# EAGLE design PiHome_Smart_Home_Gateway_v08_HT7833 (EAGLE 9.5.2)
PiHome - Smart Heating, Ventilation and Air Conditioning (HVAC) Wi-Fi Smart Home Gateway based on MySensors library with NodeMCU and nRF24L01 PA LNA Note: Power by micro USB with minimum 2amp for better performance. For more information on PiHome Smart Heating: http://www.pihome.eu
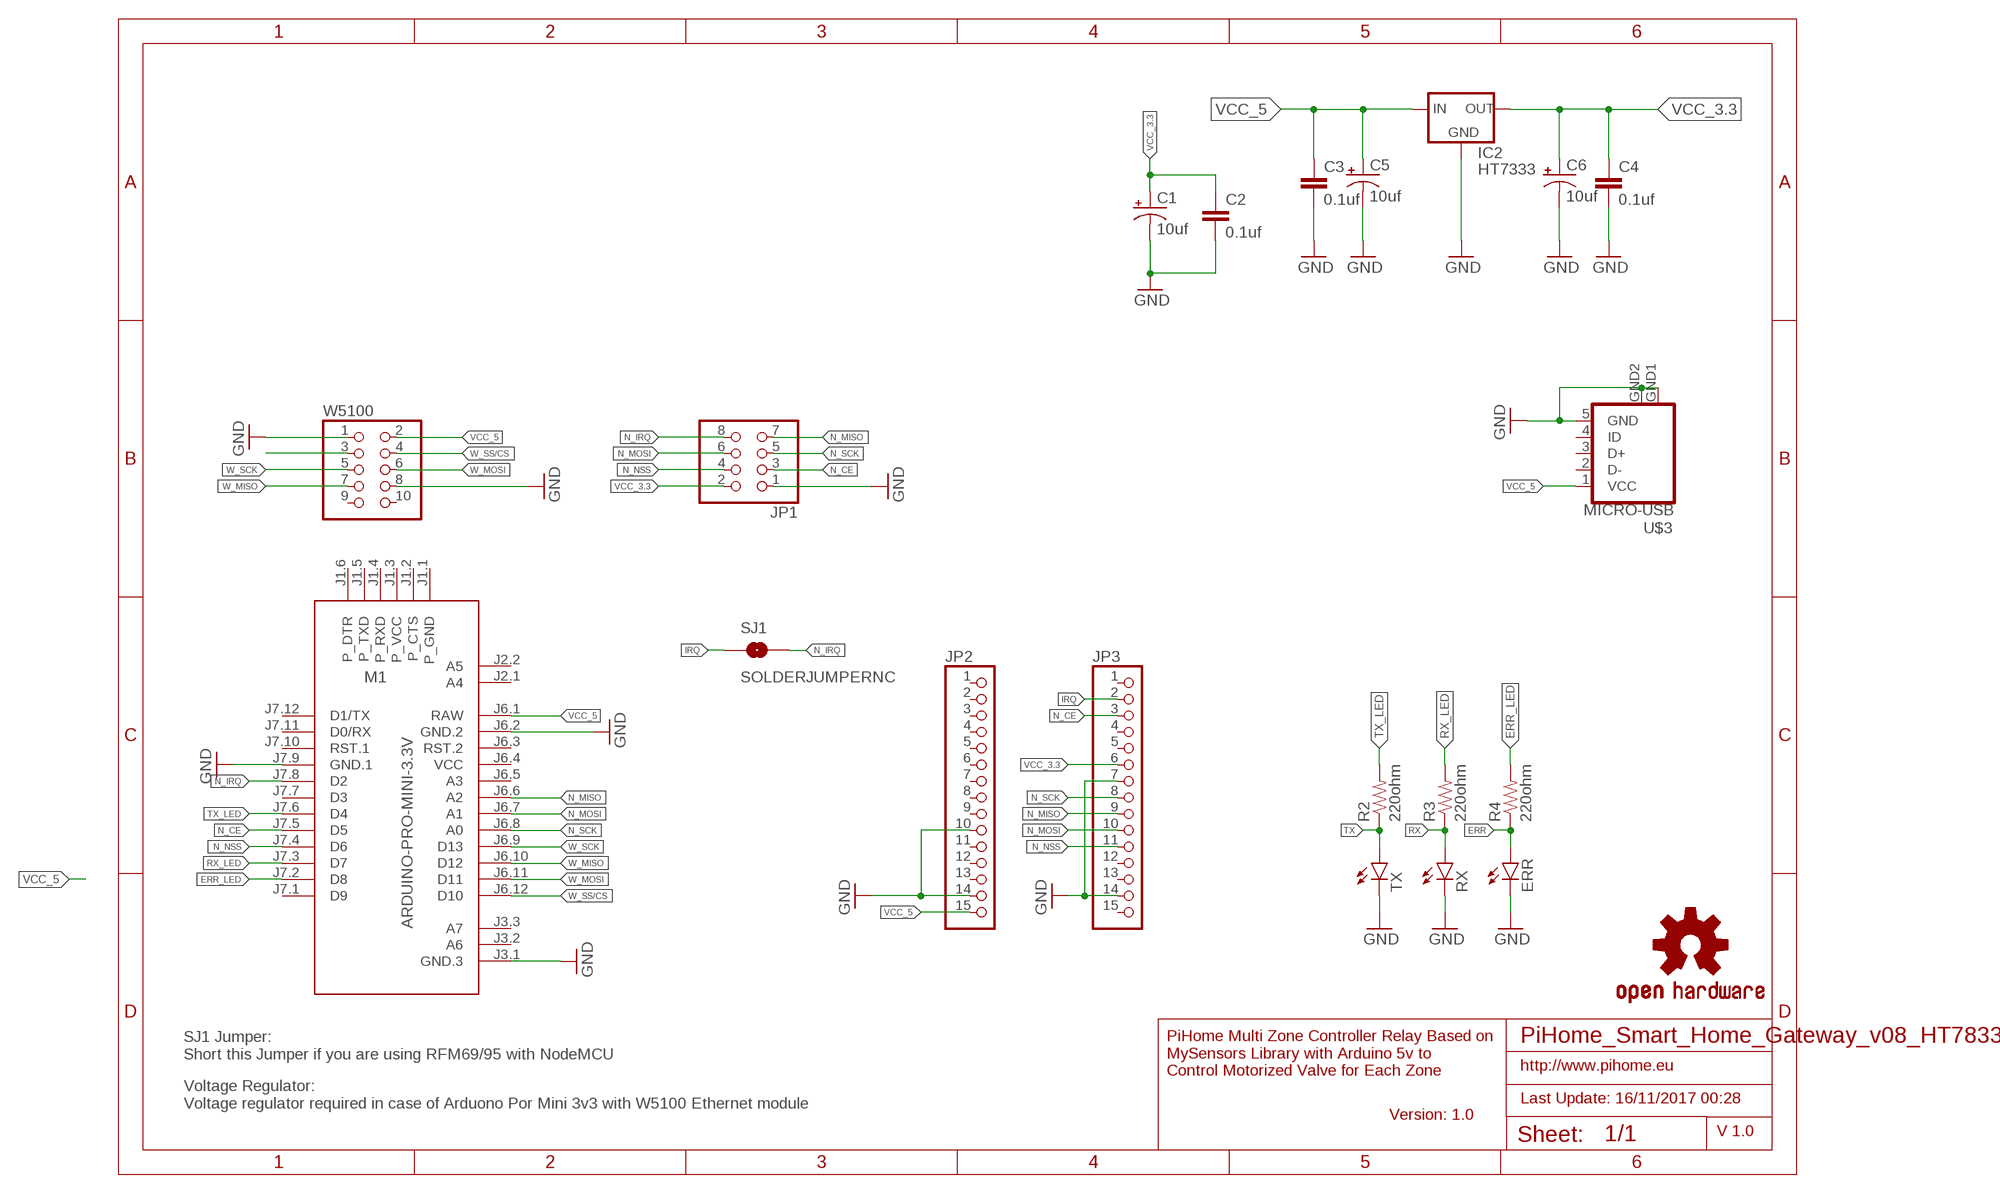
[diagram p0: schematic, sheet 1]

## Parts
C1  10uf  10UF-25V-20%(PTH)KIT  [CPOL-RADIAL-10UF-25V-KIT]
C2  0.1uf  0.1UF-50V-20%(PTH)KIT-EZ  [CAP-PTH-SMALL-KIT]
C3  0.1uf  0.1UF-50V-20%(PTH)KIT-EZ  [CAP-PTH-SMALL-KIT]
C4  0.1uf  0.1UF-50V-20%(PTH)KIT-EZ  [CAP-PTH-SMALL-KIT]
C5  10uf  10UF-25V-20%(PTH)KIT  [CPOL-RADIAL-10UF-25V-KIT]
C6  10uf  10UF-25V-20%(PTH)KIT  [CPOL-RADIAL-10UF-25V-KIT]
ERR  LED3MM  [LED3MM]
IC2  HT7333  [SOT-89]
JP1  PINHD-2X4  [2X04]
JP2  PINHD-1X15-CB  [1X15-CB]
JP3  PINHD-1X15-CB  [1X15-CB]
LOGO1  OSHW-LOGOMINI  [OSHW-LOGO-MINI]
M1  ARDUINO-PRO-MINI-3.3V  [ARDUINO-PRO-MINI]
R2  220ohm  RESISTORAXIAL-0.3  [AXIAL-0.3]
R3  220ohm  RESISTORAXIAL-0.3  [AXIAL-0.3]
R4  220ohm  RESISTORAXIAL-0.3  [AXIAL-0.3]
RX  LED3MM  [LED3MM]
SJ1  SOLDERJUMPERNC  [SJ_2S]
TX  LED3MM  [LED3MM]
U$3  MICRO-USB  [MICRO-USB]
W5100  PINHD-2X5  [2X05]

## Nets
ERR: ERR.A R4.P$1
ERR_LED: M1.J7.2(D8) R4.P$2
GND: C1.2(-) C2.2 C3.2 C4.2 C5.2(-) C6.2(-) ERR.K(C) IC2.2(GND) JP1.1 JP2.10 JP2.14 JP3.7 JP3.14 M1.J3.1(GND.3) M1.J6.2(GND.2) M1.J7.9(GND.1) RX.K(C) TX.K(C) U$3.5(GND) U$3.GND1(GND) U$3.GND2(GND) W5100.1 W5100.8
IRQ: JP3.2 SJ1.1
N$1: W5100.3
N_CE: JP1.3 JP3.3 M1.J7.5(D5)
N_IRQ: JP1.8 M1.J7.8(D2) SJ1.2
N_MISO: JP1.7 JP3.9 M1.J6.6(A2)
N_MOSI: JP1.6 JP3.10 M1.J6.7(A1)
N_NSS: JP1.4 JP3.11 M1.J7.4(D6)
N_SCK: JP1.5 JP3.8 M1.J6.8(A0)
RX: R3.P$1 RX.A
RX_LED: M1.J7.3(D7) R3.P$2
TX: R2.P$1 TX.A
TX_LED: M1.J7.6(D4) R2.P$2
VCC_3.3: C1.1(+) C2.1 C4.1 C6.1(+) IC2.1(OUT) JP1.2 JP3.6
VCC_5: C3.1 C5.1(+) IC2.3(IN) IC2.4(IN) JP2.15 M1.J6.1(RAW) U$3.1(VCC) W5100.2
W_MISO: M1.J6.10(D12) W5100.7
W_MOSI: M1.J6.11(D11) W5100.6
W_SCK: M1.J6.9(D13) W5100.5
W_SS/CS: M1.J6.12(D10) W5100.4
Unconnected: JP2.1 JP2.2 JP2.3 JP2.4 JP2.5 JP2.6 JP2.7 JP2.8 JP2.9 JP2.11 JP2.12 JP2.13 JP3.1 JP3.4 JP3.5 JP3.12 JP3.13 JP3.15 M1.J1.1(P_GND) M1.J1.2(P_CTS) M1.J1.3(P_VCC) M1.J1.4(P_RXD) M1.J1.5(P_TXD) M1.J1.6(P_DTR) M1.J2.1(A4) M1.J2.2(A5) M1.J3.2(A6) M1.J3.3(A7) M1.J6.3(RST.2) M1.J6.5(A3) M1.J7.1(D9) M1.J7.7(D3) M1.J7.10(RST.1) M1.J7.11(D0/RX) M1.J7.12(D1/TX) U$3.2(D-) U$3.3(D+) U$3.4(ID) W5100.9 W5100.10

## Notes on the sheet
- SJ1 Jumper:
  Short this Jumper if you are using RFM69/95 with NodeMCU
- http://www.pihome.eu
- PiHome Multi Zone Controller Relay Based on
  MySensors Library with Arduino 5v to 
  Control Motorized Valve for Each Zone
- Last Update: 16/11/2017 00:28
- Voltage Regulator:
  Voltage regulator required in case of Arduono Por Mini 3v3 with W5100 Ethernet module
- Version: 1.0
- V 1.0

## Power pins joined to a net without a drawn wire
VCC: M1.J6.4(VCC)

## Library data of the parts
C1 C5 C6 = SparkFun-Capacitors:10UF-25V-20%(PTH): CAP-08440; PROD_ID: CAP-08440
C2-C4 = SparkFun-Capacitors:0.1UF-50V-20%(PTH): CAP-08370; PROD_ID: CAP-08370
ERR RX TX = SparkFun-LED:LED: LEDs Standard schematic elements and footprints for 5mm, 3mm, 1206, and 0603 sized LEDs. 5mm - Spark Fun Electronics SKU : COM-00529 (and others); PROD_ID: DIO-08794
IC2 = holtek2:HT73*
JP1 = adafruit:PINHD-2X4: PIN HEADER
JP2 JP3 = adafruit:PINHD-1X15: PIN HEADER
LOGO1 = SparkFun-Aesthetics:OSHW-LOGO: Open-Source Hardware (OSHW) Logo This logo indicates the piece of hardware it is found on incorporates a OSHW license and/or adheres to the definition of open source hardware found here: http://freedomdefined.org/OSHW
M1 = diy-modules:ARDUINO-PRO-MINI-*: Arduino Pro Mini and compatible devices More details available here: https://www.arduino.cc/en/Main/ArduinoBoardProMini Click here to find device on ebay.com <http://www.ebay.com/sch/arduino+pro+mini>
R2-R4 = SparkFun-Passives:RESISTOR: Resistor Basic schematic elements and footprints for 0603, 1206, and PTH resistors.
SJ1 = SparkFun-Retired:SOLDERJUMPER: Solder Jumper Standard SMD solder jumper. Used to automate production. Two varients : Normally Open and Normally Closed are the same, but have different paste layers. NC will have a large amount of paste and should jumper during reflow.
U$3 = microusb:MICRO-USB: Micro USB B connector
W5100 = pinhead:PINHD-2X5: PIN HEADER

## Net classes
0 default: width 0.254 mm, drill 0.076 mm, clearance 0.178 mm

## Board
PiHome - Smart Heating, Ventilation and Air Conditioning (HVAC) Wi-Fi Smart Home Gateway based on MySensors library with NodeMCU and nRF24L01 PA LNA Note: Power by micro USB with minimum 2amp for better performance. For more information on PiHome Smart Heating: http://www.pihome.eu
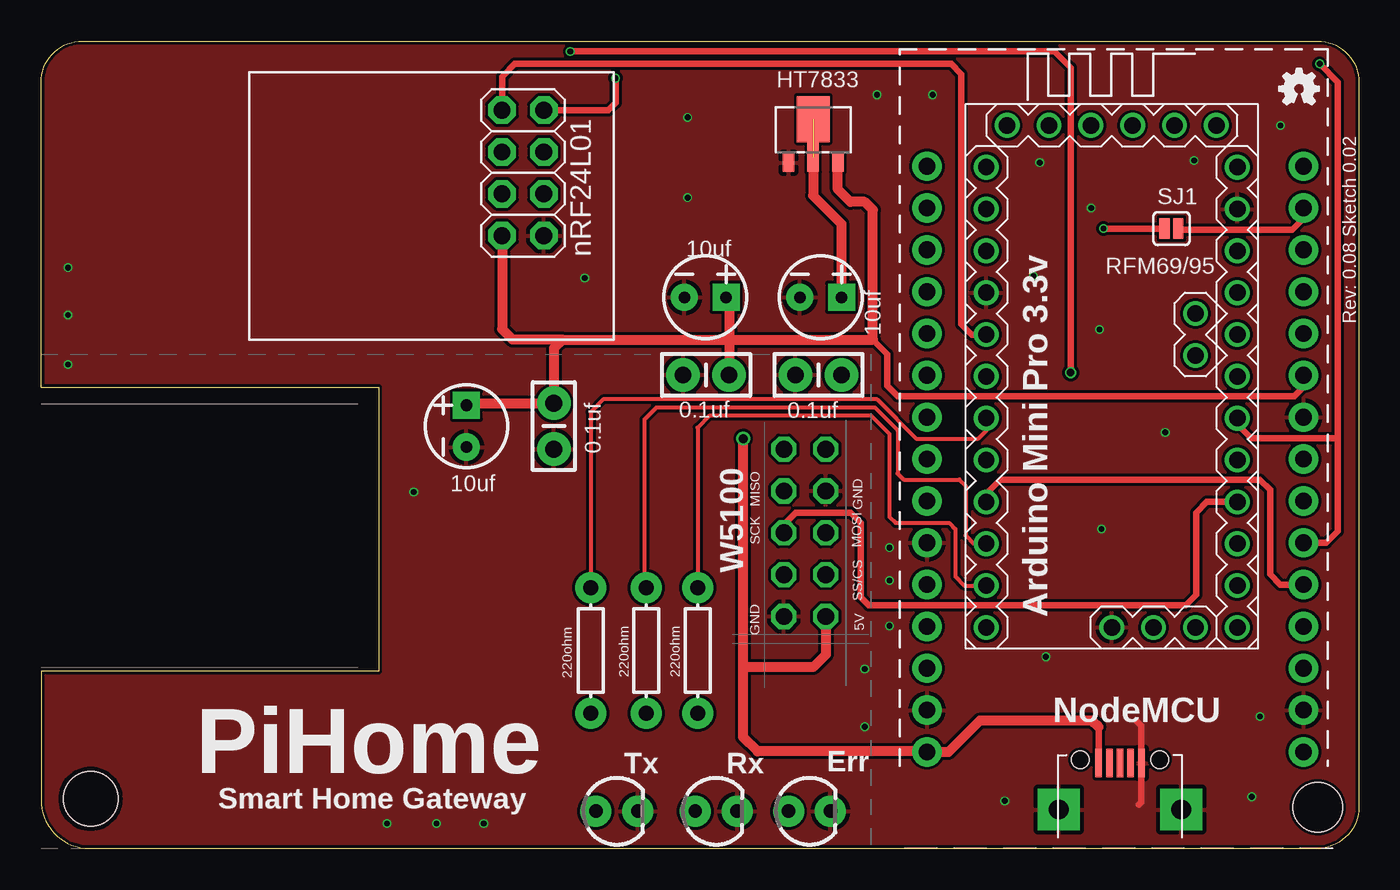
[diagram p1: board, top side]
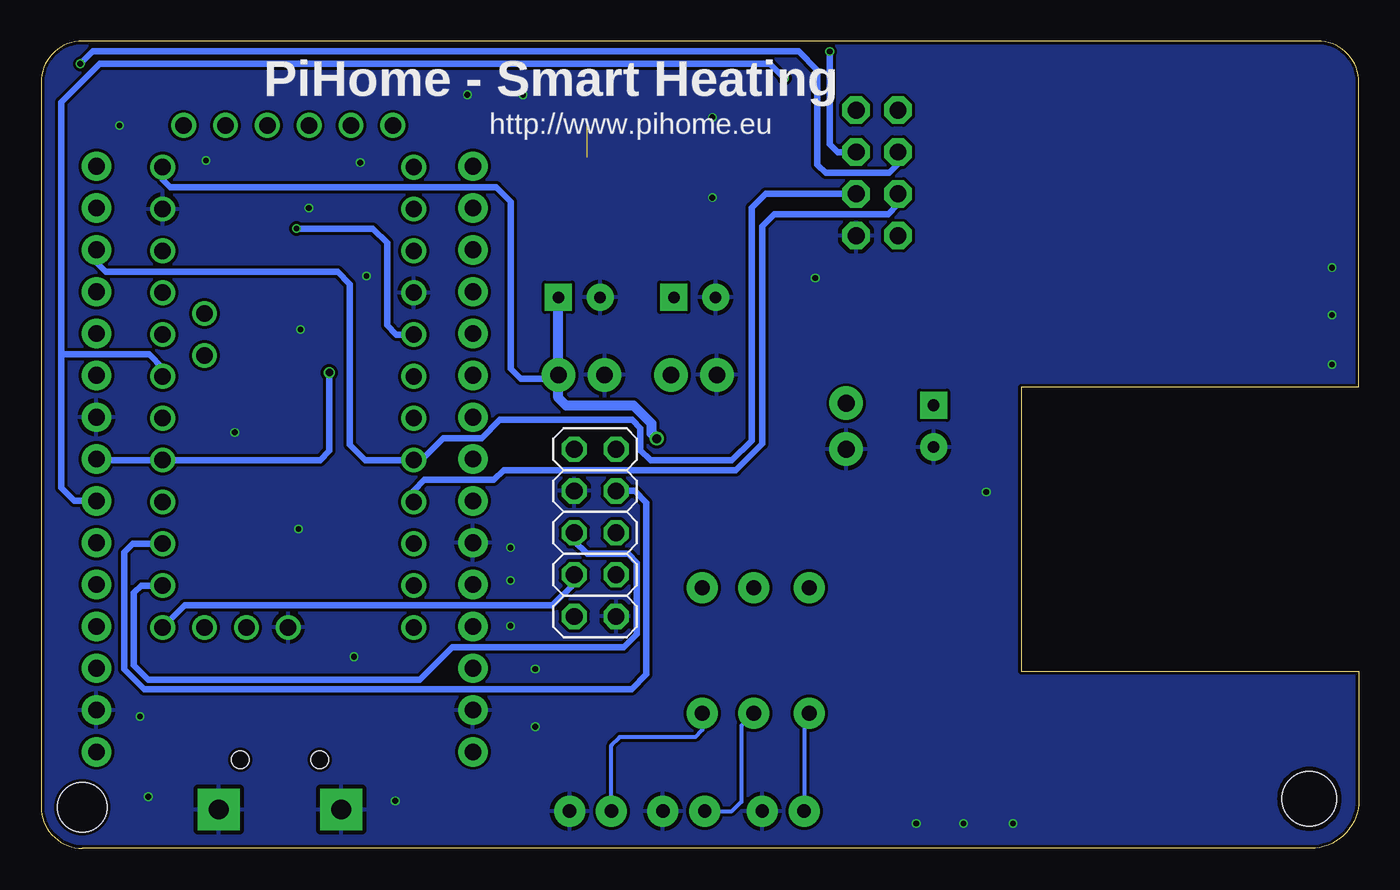
[diagram p2: board, bottom side, seen from below]

Size 80 x 49.01 mm. Coordinates in mm from the lower left corner, seen from the top.
Outline: 3.17,0.01 77.5,0.01 arc90 80,2.51 80,46.51 arc90 77.5,49.01 2.5,49.01 arc90 0,46.51 0,28.01 20.5,28.01 20.5,10.76 0,10.76 0,2.69 arc90 3.17,0.01
Copper layers (1*16): Top 0.035559375mm / dielectric 1.6mm / Bottom 0.035559375mm
Design rules "PiHome - JLCPCB 2 Layer": minimum track width 5mil, minimum drill 12mil, track to track 5mil, track to pad 5mil, pad to pad 5mil, via to via 5mil, smd to smd 5mil, copper to edge 8mil, drill to drill 6mil, minimum pad ring 5mil, minimum via ring 3mil, stop-mask expansion 2.5mil, vias tented up to drill 0mil, thermal gap 10mil
Holes 3 mm at 77.5,2.51

### Footprints (pad centres in the part's own frame; a part is rotated, then mirrored left to right if it is on the bottom)
CPOL-RADIAL-10UF-25V-KIT = drill 0.7 pad 1.651 square: 1 1.27,0 | drill 0.7 pad 1.651: 2 -1.27,0
CAP-PTH-SMALL-KIT = drill 1.016 pad 2.032: 1 -1.397,0; 2 1.397,0
LED3MM = drill 0.813 pad 1.88: A -1.27,0; K 1.27,0
SOT-89 = smd 0.7 x 1.1: 1 1.5,-2.385; 2 -1.5,-2.385 | smd 0.7 x 1.8: 3 0,-2.035 | smd 2 x 2.8: 4 0,0.265
2X04 = drill 1.016 pad 1.676 octagon: 1 -3.81,-1.27; 2 -3.81,1.27; 3 -1.27,-1.27; 4 -1.27,1.27; 5 1.27,-1.27; 6 1.27,1.27; 7 3.81,-1.27; 8 3.81,1.27
1X15-CB = drill 1.016 pad 1.778: 1 -17.78,0; 2 -15.24,0; 3 -12.7,0; 4 -10.16,0; 5 -7.62,0; 6 -5.08,0; 7 -2.54,0; 8 0,0; 9 2.54,0; 10 5.08,0; 11 7.62,0; 12 10.16,0; 13 12.7,0; 14 15.24,0; 15 17.78,0
ARDUINO-PRO-MINI = drill 1: J1.1 -15.24,6.35; J1.2 -15.24,3.81; J1.3 -15.24,1.27; J1.4 -15.24,-1.27; J1.5 -15.24,-3.81; J1.6 -15.24,-6.35; J2.1 -1.27,5.08; J2.2 -3.81,5.08; J3.1 15.24,0; J3.2 15.24,2.54; J3.3 15.24,5.08; J6.1 -12.7,7.62; J6.2 -10.16,7.62; J6.3 -7.62,7.62; J6.4 -5.08,7.62; J6.5 -2.54,7.62; J6.6 0,7.62; J6.7 2.54,7.62; J6.8 5.08,7.62; J6.9 7.62,7.62; J6.10 10.16,7.62; J6.11 12.7,7.62; J6.12 15.24,7.62; J7.1 15.24,-7.62; J7.2 12.7,-7.62; J7.3 10.16,-7.62; J7.4 7.62,-7.62; J7.5 5.08,-7.62; J7.6 2.54,-7.62; J7.7 0,-7.62; J7.8 -2.54,-7.62; J7.9 -5.08,-7.62; J7.10 -7.62,-7.62; J7.11 -10.16,-7.62; J7.12 -12.7,-7.62
AXIAL-0.3 = drill 0.9 pad 1.88: P$1 -3.81,0; P$2 3.81,0
SJ_2S = smd 0.635 x 1.27: 1 -0.412,0; 2 0.412,0
STAND-OFF = hole 3.302: 0,0
MICRO-USB = smd 0.4 x 1.75: 1 -1.3,4.525; 2 -0.65,4.525; 3 0,4.525; 4 0.65,4.525; 5 1.3,4.525 | drill 1.2 pad 2.54 square: GND1 -3.725,1.7; GND2 3.725,1.7 | hole 1.05: -2.425,4.73; 2.425,4.73
2X05 = drill 1.016 octagon: 1 -5.08,-1.27; 2 -5.08,1.27; 3 -2.54,-1.27; 4 -2.54,1.27; 5 0,-1.27; 6 0,1.27; 7 2.54,-1.27; 8 2.54,1.27; 9 5.08,-1.27; 10 5.08,1.27

### Placement (x,y rotation side)
C1  25.82,25.64 90 top
C2  31.12,25.64 270 top
C3  47.2,28.75 180 top
C4  40.37,28.75 180 top
C5  47.33,33.46 0 top
C6  40.32,33.46 0 top
ERR  46.65,2.26 0 top
IC2  46.88,44.01 0 top
JP1  29.25,41.01 90 top
JP2  53.78,23.64 270 top
JP3  76.64,23.64 270 top
LOGO1  76.38,46.14 0 top
M1  65,28.66 270 top
R2  33.36,12.01 90 top
R3  36.74,12.01 90 top
R4  39.85,12.01 90 top
RX  40.98,2.26 0 top
SJ1  68.62,37.64 180 top
TX  34.95,2.26 0 top
U$2  [STAND-OFF]  3,3.01 0 top
U$3  65.5,0.66 0 top
W5100  46.37,19.16 90 bottom

### Tracks (layer width: path | path; a pad name or v marks a point on that pad's centre or on a via)
ERR
  Bottom 0.254: R4.P$1 39.85,7.2 40.3,6.76 44.88,6.76 45.38,6.26 ERR.A
ERR_LED
  Top 0.254: M1.J7.2 56.05,15.96 55.5,16.51 55.5,19.39 55.12,19.76 51.88,19.76 51.5,20.14 51.5,25.17 50.4,26.27 40.57,26.27 39.85,25.55 R4.P$2
GND  (via drill 0.35)
  Top 0.406: 66.5,7.76 66.8,7.46 U$3.5 66.8,2.81 66.62,2.64
  other vias: 1.62,35.26 68.25,25.26 64.38,19.39 60.25,34.76 64.25,31.51 70,41.76 75.25,43.89 74,8.01 58.5,2.89 73.5,3.14 24,1.51 1.62,29.39 1.62,32.39 50.75,45.76 63.75,38.89 60.62,41.64 51.5,18.26 50,7.39 50,10.89 39.25,39.51 26.88,1.51 61,11.64 21,1.51 54.12,45.76 39.25,44.39 22.62,21.64 33,34.64 51.5,16.26 51.5,13.51
  pour Top: 0,0.01 0,10.76 20.5,10.76 20.5,28.01 0,28.01 0,49.01 80,49.01 80,0.01
  pour Bottom: 0,0.01 80,0.01 80,49.01 0,49.01 0,28.01 20.5,28.01 20.5,10.76 0,10.76
IRQ
  Top 0.406: JP3.2 76.64,38.26 75.96,37.57 69.1,37.57 SJ1.1
N_CE
  Bottom 0.406: JP3.3 76.64,35.59 76.06,35.01 62,35.01 61.25,34.26 61.25,24.51 60.32,23.58 M1.J7.5 56.93,23.58 55.6,24.91 53.26,24.91 52.16,26.01 44.12,26.01 43.62,25.51 43.62,24.18 43,23.56 38.06,23.56 36.87,24.75 36.87,38.89 36.01,39.74 JP1.3
N_IRQ  (via drill 0.35)
  Top 0.406: M1.J7.8 56.51,31.2 55.88,31.83 55.88,47.01 55.26,47.63 28.74,47.63 27.98,46.87 JP1.8 | v64.5,37.64 SJ1.2
  Bottom 0.406: M1.J7.8 58.44,31.2 59,31.76 59,36.76 59.88,37.64 v64.5,37.64
N_MISO  (via drill 0.35)
  Top 0.406: JP1.7 34.44,44.82 34.88,45.26 v34.88,46.76
  Bottom 0.406: M1.J6.6 72.62,29.16 73.45,29.99 77.17,29.99 77.19,30.01 78.78,30.01 | 78.78,30.01 78.78,45.3 76.44,47.64 35.75,47.64 v34.88,46.76 | 78.78,30.01 78.78,21.89 78,21.1 JP3.9
N_MOSI  (via drill 0.35)
  Top 0.406: JP3.10 78.03,18.56 78.73,19.26 78.73,25.01 | v77.62,47.64 78.73,46.53 78.73,25.01 | M1.J6.7 72.62,25.75 73.45,24.91 78.63,24.91 78.73,25.01
  Bottom 0.406: JP1.6 27.98,41.53 28.5,41.01 32.38,41.01 32.88,41.51 32.88,47.26 34,48.39 76.88,48.39 v77.62,47.64
N_NSS
  Top 0.406: M1.J7.4 57.38,21.54 58.23,22.39 74,22.39 74.62,21.76 74.62,16.64 75.24,16.02 JP3.11
  Bottom 0.406: JP1.4 27.98,39.12 28.59,38.51 35.5,38.51 36.22,37.79 36.22,24.57 37.82,22.97 51.91,22.97 52.52,22.37 56.73,22.37 57.38,21.73 M1.J7.4
N_SCK  (via drill 0.35, 0.45)
  Top 0.406: v62.5,28.89 62.5,47.39 61.5,48.39 v32.12,48.39
  Bottom 0.406: v62.5,28.89 62.5,24.14 63.05,23.58 M1.J6.8 76.58,23.58 JP3.8 | JP1.5 31.64,42.28 32.12,42.76 v32.12,48.39
RX
  Bottom 0.254: RX.A 38.06,2.26 37.49,2.83 37.49,7.45 R3.P$1
RX_LED
  Top 0.254: M1.J7.3 56.63,18.5 56.12,19.01 56.12,22.01 55.75,22.39 52.38,22.39 52,22.76 52,25.39 50.61,26.78 37.36,26.78 36.62,26.04 36.62,15.95 R3.P$2
TX
  Bottom 0.254: R2.P$1 33.68,7.88 TX.A
TX_LED
  Top 0.254: M1.J7.6 57.38,25.37 56.9,24.89 53.12,24.89 50.75,27.26 34.12,27.26 33.36,26.5 R2.P$2
VCC_3.3
  Top 0.406: JP3.6 76.64,28.03 76.06,27.45 52.01,27.45 51.38,28.08 51.38,30.01 50.5,30.89
  Top 0.61: C6.1 41.77,33.28 41.77,30.89 | 41.77,30.89 C4.1 | 31.62,30.89 41.77,30.89 | 31.62,30.89 28.62,30.89 27.98,31.53 JP1.2 | 31.62,30.89 31.12,30.39 C2.1 25.94,27.03 C1.1 | 41.77,30.89 50.5,30.89 50.5,38.76 50,39.26 49.12,39.26 48.38,40.01 IC2.1
VCC_5  (via drill 0.55)  (1 unrouted)
  Top 0.406: U$3.1 64.2,7.39
  Top 0.61: 64.2,7.39 63.83,7.76 57,7.76 55.1,5.86 JP2.15 53.76,5.89 43.5,5.89 42.62,6.76 42.62,11.01 | 42.62,11.01 v42.62,24.89 | W5100.2 47.63,11.77 46.88,11.01 42.62,11.01 | C5.1 48.6,37.91 46.88,39.64 IC2.4
  Bottom 0.406: M1.J6.1 72.62,40.61 72.16,40.15 53.26,40.15 53.24,40.14 52.38,40.14 51.5,39.26 51.5,29.14 50.88,28.51 48.83,28.51 C3.1
  Bottom 0.61: v42.62,24.89 42.94,25.2 42.94,25.79 44.03,26.89 48.12,26.89 48.59,27.35 C3.1 C5.1
W_MISO
  Bottom 0.406: M1.J6.10 74.43,18.5 74.96,17.97 74.96,10.88 73.74,9.67 56.77,9.67 56.76,9.67 44.15,9.67 43.25,10.57 43.25,20.98 43.97,21.7 W5100.7
W_MOSI
  Bottom 0.406: M1.J6.11 73.92,15.96 74.38,15.51 74.38,11.13 73.5,10.25 57.01,10.25 55.05,12.21 53.26,12.21 53.25,12.2 44.64,12.2 43.83,13.01 43.83,17.35 44.37,17.89 46.86,17.89 47.63,18.66 W5100.6
W_SCK
  Top 0.406: M1.J6.9 70.78,21.04 70.12,20.39 70.12,15.39 69.49,14.75 50.26,14.75 49.75,15.26 49.75,19.79 49.15,20.39 45.82,20.39 45.09,19.66 W5100.5
W_SS/CS
  Bottom 0.406: M1.J6.12 71.29,14.75 48.96,14.75 47.63,16.07 W5100.4

### Text on the board
tPlace: HT7833 | 10uf | nRF24L01 | RFM69/95 | Rev: 0.08 Sketch 0.02 | 10uf | 0.1uf | 0.1uf | 0.1uf | 10uf | W5100 | GND | MISO | SCK | MOSI | GND | SS/CS | 5V | Arduino Mini Pro 3.3v | NodeMCU | Tx | Rx | Err | PiHome | Smart Home Gateway
bPlace: PiHome - Smart Heating | http://www.pihome.eu